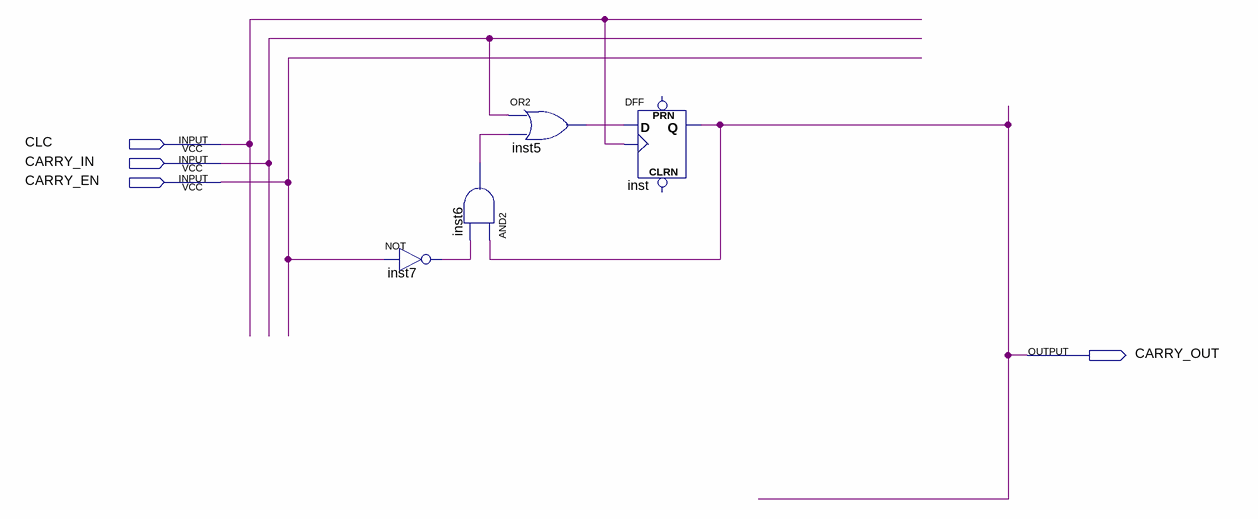
[diagram p0: schematic sheet]
// Quartus schematic SYSTEM_REG.bdf as structural Verilog: 4 symbols, 4 pins
module SYSTEM_REG (
  input  CLC,
  input  CARRY_IN,
  input  CARRY_EN,
  output CARRY_OUT
);

  wire inst5_out, inst6_out, inst7_out;

  not inst7 (inst7_out, CARRY_EN);
  or inst5 (inst5_out, CARRY_IN, inst6_out);
  and inst6 (inst6_out, CARRY_OUT, inst7_out);
  DFF inst (.CLK(CLC), .D(inst5_out), .Q(CARRY_OUT));  // open: CLRN, PRN
endmodule
